# EasyEDA Pro project ProProject_阵列式磁场检测仪_2024-06-02.epro, schematic Schematic3
Create Date: 2024-05-17; Page Name: P1; Project Name: 阵列式磁场检测仪; Schematic Name: Schematic3; Update Date: 2024-05-17; Company: 嘉立创EDA; Page Size: A4; Version: V1.0
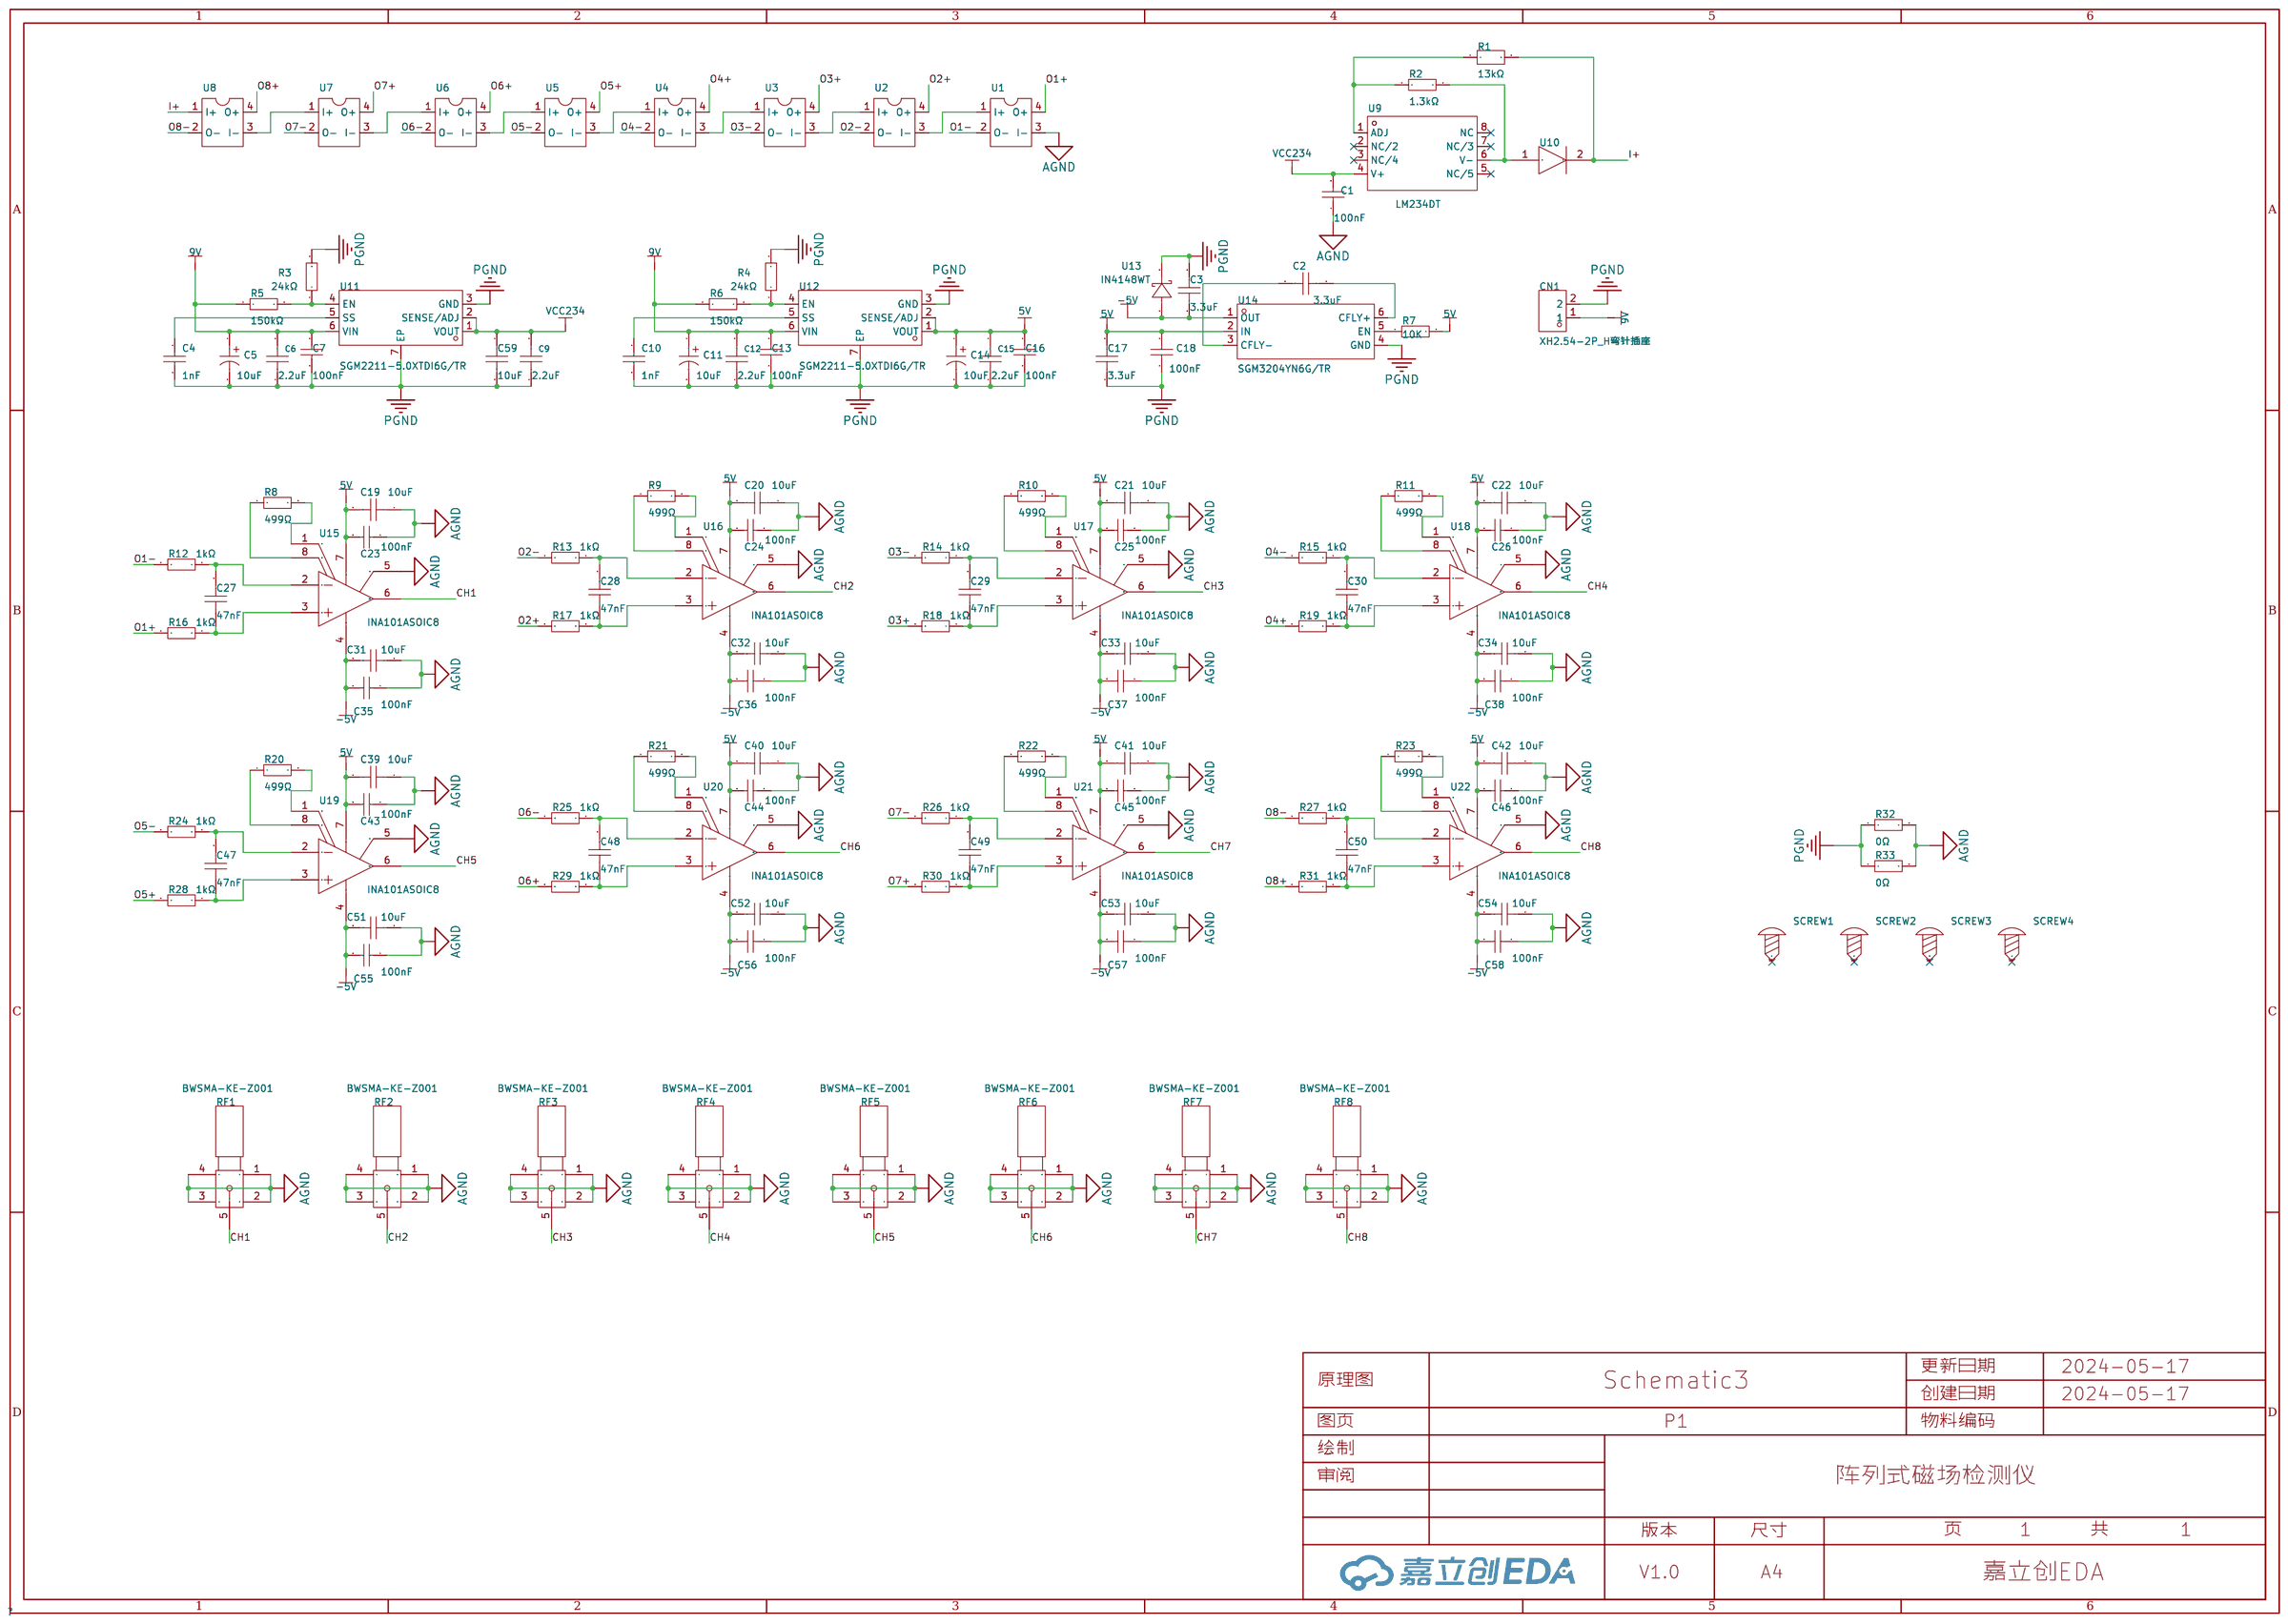
[diagram p3: schematic sheet]

## Parts
C1  100nF  [C0603]
C2  3.3uF  [C0603]
C3  3.3uF  [C0603]
C4  1nF  [C0603]
C5  10uF  [CAP-SMD_BD5.0-L5.3-W5.3-FD]
C6  2.2uF  [C0603]
C7  100nF  [C0603]
C9  2.2uF  [C0603]
C10  1nF  [C0603]
C11  10uF  [CAP-SMD_BD5.0-L5.3-W5.3-FD]
C12  2.2uF  [C0603]
C13  100nF  [C0603]
C14  10uF  [CAP-SMD_BD5.0-L5.3-W5.3-FD]
C15  2.2uF  [C0603]
C16  100nF  [C0603]
C17  3.3uF  [C0603]
C18  100nF  [C0603]
C19  10uF  [C0805]
C20  10uF  [C0805]
C21  10uF  [C0805]
C22  10uF  [C0805]
C23  100nF  [C0603]
C24  100nF  [C0603]
C25  100nF  [C0603]
C26  100nF  [C0603]
C27  47nF  [C0603]
C28  47nF  [C0603]
C29  47nF  [C0603]
C30  47nF  [C0603]
C31  10uF  [C0805]
C32  10uF  [C0805]
C33  10uF  [C0805]
C34  10uF  [C0805]
C35  100nF  [C0603]
C36  100nF  [C0603]
C37  100nF  [C0603]
C38  100nF  [C0603]
C39  10uF  [C0805]
C40  10uF  [C0805]
C41  10uF  [C0805]
C42  10uF  [C0805]
C43  100nF  [C0603]
C44  100nF  [C0603]
C45  100nF  [C0603]
C46  100nF  [C0603]
C47  47nF  [C0603]
C48  47nF  [C0603]
C49  47nF  [C0603]
C50  47nF  [C0603]
C51  10uF  [C0805]
C52  10uF  [C0805]
C53  10uF  [C0805]
C54  10uF  [C0805]
C55  100nF  [C0603]
C56  100nF  [C0603]
C57  100nF  [C0603]
C58  100nF  [C0603]
C59  10uF  [C0805]
CN1  XH2.54-2P_H弯针插座  [CONN-TH_2P-P2.5_XH2.54-2P_H]
R1  13kΩ  [R0603]
R2  1.3kΩ  [R0603]
R3  24kΩ  [R0603]
R4  24kΩ  [R0603]
R5  150kΩ  [R0603]
R6  150kΩ  [R0603]
R7  10K  [R0603]
R8  499Ω  [R0603]
R9  499Ω  [R0603]
R10  499Ω  [R0603]
R11  499Ω  [R0603]
R12  1kΩ  [R0603]
R13  1kΩ  [R0603]
R14  1kΩ  [R0603]
R15  1kΩ  [R0603]
R16  1kΩ  [R0603]
R17  1kΩ  [R0603]
R18  1kΩ  [R0603]
R19  1kΩ  [R0603]
R20  499Ω  [R0603]
R21  499Ω  [R0603]
R22  499Ω  [R0603]
R23  499Ω  [R0603]
R24  1kΩ  [R0603]
R25  1kΩ  [R0603]
R26  1kΩ  [R0603]
R27  1kΩ  [R0603]
R28  1kΩ  [R0603]
R29  1kΩ  [R0603]
R30  1kΩ  [R0603]
R31  1kΩ  [R0603]
R32  0Ω  [R1206]
R33  0Ω  [R1206]
RF1  BWSMA-KE-Z001  [SMA-TH_BWSMA-KE-Z001]
RF2  BWSMA-KE-Z001  [SMA-TH_BWSMA-KE-Z001]
RF3  BWSMA-KE-Z001  [SMA-TH_BWSMA-KE-Z001]
RF4  BWSMA-KE-Z001  [SMA-TH_BWSMA-KE-Z001]
RF5  BWSMA-KE-Z001  [SMA-TH_BWSMA-KE-Z001]
RF6  BWSMA-KE-Z001  [SMA-TH_BWSMA-KE-Z001]
RF7  BWSMA-KE-Z001  [SMA-TH_BWSMA-KE-Z001]
RF8  BWSMA-KE-Z001  [SMA-TH_BWSMA-KE-Z001]
SCREW1  -  [M3螺丝]
SCREW2  -  [M3螺丝]
SCREW3  -  [M3螺丝]
SCREW4  -  [M3螺丝]
U1  -  [HALL]
U2  -  [HALL]
U3  -  [HALL]
U4  -  [HALL]
U5  -  [HALL]
U6  -  [HALL]
U7  -  [HALL]
U8  -  [HALL]
U9  LM234DT  [SOIC-8_L4.9-W3.9-P1.27-LS6.0-BL]
U10  -  [IN457]
U11  SGM2211-5.0XTDI6G/TR  [TDFN-6_L2.0-W2.0-P0.65-BL-EP]
U12  SGM2211-5.0XTDI6G/TR  [TDFN-6_L2.0-W2.0-P0.65-BL-EP]
U13  IN4148WT  [SOD-523_L1.2-W0.8-LS1.6-FD]
U14  SGM3204YN6G/TR  [SOT-23-6_L2.9-W1.6-P0.95-LS2.8-BR]
U15  INA101ASOIC8  [SOIC-8_L4.9-W3.9-P1.27-LS6.0-BL]
U16  INA101ASOIC8  [SOIC-8_L4.9-W3.9-P1.27-LS6.0-BL]
U17  INA101ASOIC8  [SOIC-8_L4.9-W3.9-P1.27-LS6.0-BL]
U18  INA101ASOIC8  [SOIC-8_L4.9-W3.9-P1.27-LS6.0-BL]
U19  INA101ASOIC8  [SOIC-8_L4.9-W3.9-P1.27-LS6.0-BL]
U20  INA101ASOIC8  [SOIC-8_L4.9-W3.9-P1.27-LS6.0-BL]
U21  INA101ASOIC8  [SOIC-8_L4.9-W3.9-P1.27-LS6.0-BL]
U22  INA101ASOIC8  [SOIC-8_L4.9-W3.9-P1.27-LS6.0-BL]

## Library data of the parts
C1 C7 C13 C16 C18 C23-C26 C35-C38 C43-C46 C55-C58 = 0603B104K500NT: 容值:100nF;精度:±10%;额定电压:50V;材质(温度系数):X7R;; LCSC Part Name: 100nF ±10% 50V; Supplier Part: C30926; Manufacturer: FH(风华); Supplier Footprint: 0603; Datasheet: https://atta.szlcsc.com/upload/public/pdf/source/20200305/C486355_26A10D38EF8C2A5C37091D0039909270.pdf; Supplier: LCSC; Tolerance: ±10%; Voltage Rated: 50V; Temperature Coefficient: X7R
C2 C3 C17 = C1608X5R1E335KT000E: 容值:3.3uF;精度:±10%;额定电压:25V;材质(温度系数):X5R;; LCSC Part Name: 3.3uF ±10% 25V; Supplier Part: C342962; Manufacturer: TDK; Supplier Footprint: 0603; Datasheet: https://atta.szlcsc.com/upload/public/pdf/source/20190612/C361180_85CC9FB0751BEA97238DE56AB4AF0B1F.pdf; Supplier: LCSC; Tolerance: ±10%; Voltage Rated: 25V; Temperature Coefficient: X5R
C4 C10 = CC0603KRX7R9BB102: 容值:1nF;精度:±10%;额定电压:50V;材质(温度系数):X7R;; LCSC Part Name: 1nF ±10% 50V; Supplier Part: C100040; Manufacturer: YAGEO(国巨); Supplier Footprint: 0603; Datasheet: https://atta.szlcsc.com/upload/public/pdf/source/20180910/C282072_33301C7F631E79921B82A8DAC6BCC5B3.pdf; Supplier: LCSC; Tolerance: ±10%; Voltage Rated: 50V; Temperature Coefficient: X7R
C5 C11 C14 = RST10UF50V016: 容值:10uF;精度:±20%;额定电压:50V;纹波电流:24mA@120Hz;等效串联电阻:-;; LCSC Part Name: 10uF ±20% 50V; Supplier Part: C4747971; Manufacturer: KNSCHA(科尼盛); Supplier Footprint: SMD,D5xL5.4mm; Datasheet: https://atta.szlcsc.com/upload/public/pdf/source/20220722/47144637C831FC4476CE4962252D8002.pdf; Supplier: LCSC; Tolerance: ±20%; Rated Voltage: 50V; Ripple Current: 24mA@120Hz; φD: 5mm; L: 5.4mm; Lifetime @ Temp: 2000hrs@105℃; Operating Temperature: -40℃~+105℃
C6 C9 C12 C15 = CL10A225KB8NNNC: 容值:2.2uF;精度:±10%;额定电压:50V;材质(温度系数):X5R;; LCSC Part Name: 2.2uF ±10% 50V; Supplier Part: C913904; Manufacturer: SAMSUNG(三星); Supplier Footprint: 0603; Datasheet: https://atta.szlcsc.com/upload/public/pdf/source/20160218/1457707763339.pdf; Supplier: LCSC; Tolerance: ±10%; Voltage Rated: 50V; Temperature Coefficient: X5R
C19-C22 C31-C34 C39-C42 C51-C54 C59 = CL21A106KAYNNNE_C15850: 容值:10uF;精度:±10%;额定电压:25V;材质(温度系数):X5R;; LCSC Part Name: 10uF ±10% 25V; Supplier Part: C15850; Manufacturer: SAMSUNG(三星); Manufacturer Part: CL21A106KAYNNNE; Supplier Footprint: 0805; Datasheet: https://atta.szlcsc.com/upload/public/pdf/source/20160218/1457707763339.pdf; Supplier: LCSC; Tolerance: ±10%; Voltage Rated: 25V; Temperature Coefficient: X5R
C27-C30 C47-C50 = 0603B473K500NT: 容值:47nF;精度:±10%;额定电压:50V;材质(温度系数):X7R;; LCSC Part Name: 47nF ±10% 50V; Supplier Part: C285123; Manufacturer: FH(风华); Supplier Footprint: 0603; JLCPCB Part Class: 扩展库; Datasheet: https://atta.szlcsc.com/upload/public/pdf/source/20200305/C486355_26A10D38EF8C2A5C37091D0039909270.pdf; Supplier: LCSC; Tolerance: ±10%; Voltage Rated: 50V; Temperature Coefficient: X7R
CN1 = XH2.54-2P_H弯针插座: Supplier Part: C2915111; Supplier Footprint: TH-2P; JLCPCB Part Class: 扩展库; Supplier: LCSC
R1 = MR06X1302FTL: 阻值:13kΩ;精度:±1%;功率:125mW;最大工作电压:75V;温度系数:±100ppm/℃;; LCSC Part Name: 13kΩ ±1% 125mW; Supplier Part: C431728; Manufacturer: Walsin(华新科); Supplier Footprint: 0603; JLCPCB Part Class: 扩展库; Datasheet: https://atta.szlcsc.com/upload/public/pdf/source/20190927/C431928_EFD0274D1DCD4BC1E8C9515D468AAF68.pdf; Supplier: LCSC; Tolerance: ±1%; Power(Watts): 125mW; Overload Voltage (Max): 75V; Temperature Coefficient: ±100ppm/℃; Operating Temperature Range: -55℃~+155℃
R2 = PTFR0603B1K30P9: 电阻类型:薄膜电阻;阻值:1.3kΩ;精度:±0.1%;功率:100mW;最大工作电压:100V;温度系数:±25ppm/℃;; LCSC Part Name: 薄膜电阻 1.3kΩ ±0.1% 100mW; Supplier Part: C351672; Manufacturer: RESI(开步睿思）; Supplier Footprint: 0603; JLCPCB Part Class: 扩展库; Datasheet: https://atta.szlcsc.com/upload/public/pdf/source/20231020/37F75D505DFC5CA75CC16B0F0ECD8764.pdf; Supplier: LCSC; Type: 薄膜电阻; Tolerance: ±0.1%; Power(Watts): 100mW; Overload Voltage (Max): 100V; Temperature Coefficient: ±25ppm/℃; Operating Temperature Range: -55℃~+125℃
R3 R4 = 0603WAF2402T5E: 电阻类型:厚膜电阻;阻值:24kΩ;精度:±1%;功率:100mW;最大工作电压:75V;温度系数:±100ppm/℃;; LCSC Part Name: 24kΩ ±1% 100mW 厚膜电阻; Supplier Part: C23352; Manufacturer: UNI-ROYAL(厚声); Supplier Footprint: 0603; JLCPCB Part Class: 基础库; Datasheet: https://atta.szlcsc.com/upload/public/pdf/source/20200306/C422600_1E6D84923E4A46A82E41ADD87F860B5C.pdf; Supplier: LCSC; Type: 厚膜电阻; Tolerance: ±1%; Power(Watts): 100mW; Overload Voltage (Max): 75V; Temperature Coefficient: ±100ppm/℃; Operating Temperature Range: -55℃~+155℃
R5 R6 = 0603WAF1503T5E: 电阻类型:厚膜电阻;阻值:150kΩ;精度:±1%;功率:100mW;最大工作电压:75V;温度系数:±100ppm/℃;; LCSC Part Name: 150kΩ ±1% 100mW 厚膜电阻; Supplier Part: C22807; Manufacturer: UNI-ROYAL(厚声); Supplier Footprint: 0603; JLCPCB Part Class: 基础库; Datasheet: https://atta.szlcsc.com/upload/public/pdf/source/20200306/C422600_1E6D84923E4A46A82E41ADD87F860B5C.pdf; Supplier: LCSC; Type: 厚膜电阻; Tolerance: ±1%; Power(Watts): 100mW; Overload Voltage (Max): 75V; Temperature Coefficient: ±100ppm/℃; Operating Temperature Range: -55℃~+155℃
R7 = Res_0603: Supplier Footprint: 0603
R8-R11 R20-R23 = 0603WAF4990T5E: 电阻类型:厚膜电阻;阻值:499Ω;精度:±1%;功率:100mW;最大工作电压:75V;温度系数:±100ppm/℃;; LCSC Part Name: 499Ω ±1% 100mW 厚膜电阻; Supplier Part: C23065; Manufacturer: UNI-ROYAL(厚声); Supplier Footprint: 0603; Datasheet: https://atta.szlcsc.com/upload/public/pdf/source/20200306/C422600_1E6D84923E4A46A82E41ADD87F860B5C.pdf; Supplier: LCSC; Type: 厚膜电阻; Tolerance: ±1%; Power(Watts): 100mW; Overload Voltage (Max): 75V; Temperature Coefficient: ±100ppm/℃; Operating Temperature Range: -55℃~+155℃
R12-R19 R24-R31 = 0603WAF1001T5E: 电阻类型:厚膜电阻;阻值:1kΩ;精度:±1%;功率:100mW;最大工作电压:75V;温度系数:±100ppm/℃;; LCSC Part Name: 1kΩ ±1% 100mW 厚膜电阻; Supplier Part: C21190; Manufacturer: UNI-ROYAL(厚声); Supplier Footprint: 0603; Datasheet: https://atta.szlcsc.com/upload/public/pdf/source/20200306/C422600_1E6D84923E4A46A82E41ADD87F860B5C.pdf; Supplier: LCSC; Type: 厚膜电阻; Tolerance: ±1%; Power(Watts): 100mW; Overload Voltage (Max): 75V; Temperature Coefficient: ±100ppm/℃; Operating Temperature Range: -55℃~+155℃
R32 R33 = 1206W4F0000T5E: 电阻类型:厚膜电阻;阻值:0Ω;精度:±1%;功率:250mW;最大工作电压:200V;温度系数:±800ppm/℃;; LCSC Part Name: 0Ω ±1% 250mW 厚膜电阻; Supplier Part: C17888; Manufacturer: UNI-ROYAL(厚声); Supplier Footprint: 1206; JLCPCB Part Class: 基础库; Datasheet: https://atta.szlcsc.com/upload/public/pdf/source/20200306/C422600_1E6D84923E4A46A82E41ADD87F860B5C.pdf; Supplier: LCSC; Type: 厚膜电阻; Tolerance: ±1%; Power(Watts): 250mW; Overload Voltage (Max): 200V; Temperature Coefficient: ±800ppm/℃; Operating Temperature Range: -55℃~+155℃
RF1-RF8 = BWSMA-KE-Z001_C496549: 连接器类型:板端;接口类型:内孔;端口数量:1;接口直径:-;接口长度/高度:-;频率-最大值:-;射频系列:SMA;阻抗:50Ω;样式:正脚;触头材质:-;触头镀层:-;工作温度范围:-65℃~+165℃;焊接温度(最大值):-;; LCSC Part Name: 内孔 SMA 正脚; Supplier Part: C496549; Manufacturer: BAT WIRELESS(蝙蝠无线); Supplier Footprint: 插件; JLCPCB Part Class: 扩展库; Datasheet: https://atta.szlcsc.com/upload/public/pdf/source/20221228/40BF41E56A06003A0210E1785CA66EA6.pdf; Supplier: LCSC; Connector Type: 板端; Interface Type: 内孔; Number of Ports: 1; RF Series: SMA; Impedance: 50Ω; Style: 正脚; Operating Temperature Range: -65℃~+165℃
SCREW1-SCREW4 = M3螺丝: Supplier Footprint: 插件
U1-U8 = HALL
U9 = LM234DT: 工作电压:1V~40V;输出电流:10mA;精度:±3%;; LCSC Part Name: 10mA 电流源 40V; Supplier Part: C157402; Manufacturer: ST(意法半导体); Supplier Footprint: SOIC-8; Datasheet: https://atta.szlcsc.com/upload/public/pdf/source/20180125/C157402_15168648817961302756.pdf; Supplier: LCSC; Type: 电流源; Supply Voltage: 1V~40V; Output Current: 10mA; Tolerance: ±3%; Operating Temperature: -25℃~+100℃
U10 = IN457
U11 U12 = SGM2211-1.8XTDI6G/TR: Supplier Part: C5152834; Manufacturer: SGMICRO(圣邦微); Supplier Footprint: TDFN-6AL(2x2); JLCPCB Part Class: 扩展库; Datasheet: https://atta.szlcsc.com/upload/public/pdf/source/20220928/26A0674FCF0885761ED3B533E1830369.pdf; Supplier: LCSC
U13 = IN4148WT: Supplier Part: C9900015724; Supplier Footprint: DIODEGENPURP100V150MASOD-523; JLCPCB Part Class: 扩展库; Supplier: LCSC
U14 = SGM3204YN6G/TR: 功能类型:-;输入电压:1.4V~5.5V;输出电压:-5.5V~-1.4V;输出电流(最大值):200mA;; Supplier Part: C194031; Manufacturer: SGMICRO(圣邦微); Supplier Footprint: SOT-23-6; Datasheet: https://atta.szlcsc.com/upload/public/pdf/source/20180627/C194031_755051E53122D645C36CF727711B963E.pdf; Supplier: LCSC; Input Voltage: 1.4V~5.5V; Output Voltage: -5.5V~-1.4V; Output Current (Max): 200mA; Switching Frequency: 950kHz; Number of Outputs: 1; Switch tube (built-in/external): 内置
U15-U22 = INA101ASOIC8: 放大器数:-;共模抑制比(CMRR):104dB;输入偏置电流(Ib):1nA;输入失调电压(Vos):2.5uV;增益带宽积(GBP):-;压摆率(SR):-;带宽(-3db):1.3MHz;轨到轨:-;; LCSC Part Name: 线性产品; Supplier Part: C5359442; Manufacturer: analogysemi(类比半导体); Supplier Footprint: SOIC-8; JLCPCB Part Class: 扩展库; Datasheet: https://atta.szlcsc.com/upload/public/pdf/source/20230221/88ECF15C5A4D3235CE0DAFCB201D4D48.pdf; Supplier: LCSC; Common Mode Rejection Ratio (CMRR): 104dB; Current - Input Bias(Ib): 1nA; Voltage - Input Offset(Vos): 2.5uV; Supply Voltage: 4V~38V; -3db Bandwidth: 1.3MHz; Supply Current: 1.56mA; Input Offset Voltage Drift (Vos TC): 0.02uV/°C; Operating Temperature: -55℃~+125℃

## Nets
5V: C14.1 C15.2 C16.2 C17.2 C18.2 C19.2 C20.2 C21.2 C22.2 C23.2 C24.2 C25.2 C26.2 C39.2 C40.2 C41.2 C42.2 C43.2 C44.2 C45.2 C46.2 R7.2 U12.1(VOUT) U12.2(SENSE/ADJ) U14.2(IN) U15.7(+VS) U16.7(+VS) U17.7(+VS) U18.7(+VS) U19.7(+VS) U20.7(+VS) U21.7(+VS) U22.7(+VS)
9V: C5.1 C6.2 C7.2 C11.1 C12.2 C13.2 CN1.1 R5.1 R6.1 U11.6(VIN) U12.6(VIN)
-5V: C3.2 C31.2 C32.2 C33.2 C34.2 C35.2 C36.2 C37.2 C38.2 C51.2 C52.2 C53.2 C54.2 C55.2 C56.2 C57.2 C58.2 U13.1(A) U14.1(OUT) U15.4(–VS) U16.4(–VS) U17.4(–VS) U18.4(–VS) U19.4(–VS) U20.4(–VS) U21.4(–VS) U22.4(–VS)
AGND: C1.1 C19.1 C20.1 C21.1 C22.1 C23.1 C24.1 C25.1 C26.1 C31.1 C32.1 C33.1 C34.1 C35.1 C36.1 C37.1 C38.1 C39.1 C40.1 C41.1 C42.1 C43.1 C44.1 C45.1 C46.1 C51.1 C52.1 C53.1 C54.1 C55.1 C56.1 C57.1 C58.1 R32.2 R33.2 RF1.1 RF1.2 RF1.3 RF1.4 RF2.1 RF2.2 RF2.3 RF2.4 RF3.1 RF3.2 RF3.3 RF3.4 RF4.1 RF4.2 RF4.3 RF4.4 RF5.1 RF5.2 RF5.3 RF5.4 RF6.1 RF6.2 RF6.3 RF6.4 RF7.1 RF7.2 RF7.3 RF7.4 RF8.1 RF8.2 RF8.3 RF8.4 U1.3(I-) U15.5(REF) U16.5(REF) U17.5(REF) U18.5(REF) U19.5(REF) U20.5(REF) U21.5(REF) U22.5(REF)
PGND: C3.1 C4.2 C5.2 C6.1 C7.1 C9.1 C10.2 C11.2 C12.1 C13.1 C14.2 C15.1 C16.1 C17.1 C18.1 C59.2 CN1.2 R3.2 R4.2 R32.1 R33.1 U11.3(GND) U11.7(EP) U12.3(GND) U12.7(EP) U13.2(K) U14.4(GND)
VCC234: C1.2 C9.2 C59.1 U9.4(V+) U11.1(VOUT) U11.2(SENSE/ADJ)
CH1: RF1.5 U15.6(OUTPUT)
CH2: RF2.5 U16.6(OUTPUT)
CH3: RF3.5 U17.6(OUTPUT)
CH4: RF4.5 U18.6(OUTPUT)
CH5: RF5.5 U19.6(OUTPUT)
CH6: RF6.5 U20.6(OUTPUT)
CH7: RF7.5 U21.6(OUTPUT)
CH8: RF8.5 U22.6(OUTPUT)
I+: R1.2 U8.1(I+) U10.2
O1+: R16.2 U1.4(O+)
O1-: R12.2 U1.2(O-)
O2+: R17.2 U2.4(O+)
O2-: R13.2 U2.2(O-)
O3+: R18.2 U3.4(O+)
O3-: R14.2 U3.2(O-)
O4+: R19.2 U4.4(O+)
O4-: R15.2 U4.2(O-)
O5+: R28.2 U5.4(O+)
O5-: R24.2 U5.2(O-)
O6+: R29.2 U6.4(O+)
O6-: R25.2 U6.2(O-)
O7+: R30.2 U7.4(O+)
O7-: R26.2 U7.2(O-)
O8+: R31.2 U8.4(O+)
O8-: R27.2 U8.2(O-)
$1N695: R2.2 U9.6(V-) U10.1
$1N696: R1.1 R2.1 U9.1(ADJ)
$1N1719: C4.1 U11.5(SS)
$1N1720: R3.1 R5.2 U11.4(EN)
$1N2456: C10.1 U12.5(SS)
$1N2457: R4.1 R6.2 U12.4(EN)
$1N2463: C2.2 U14.3(CFLY-)
$1N2464: C2.1 U14.6(CFLY+)
$1N2468: R7.1 U14.5(EN)
$1N5661: R8.1 U15.8(RG)
$1N5662: R8.2 U15.1(RG)
$1N5664: C27.1 R16.1 U15.3(+IN)
$1N5665: C27.2 R12.1 U15.2(–IN)
$1N5674: R9.1 U16.8(RG)
$1N5675: R9.2 U16.1(RG)
$1N5677: C28.1 R17.1 U16.3(+IN)
$1N5678: C28.2 R13.1 U16.2(–IN)
$1N5687: R10.1 U17.8(RG)
$1N5688: R10.2 U17.1(RG)
$1N5690: C29.1 R18.1 U17.3(+IN)
$1N5691: C29.2 R14.1 U17.2(–IN)
$1N5700: R11.1 U18.8(RG)
$1N5701: R11.2 U18.1(RG)
$1N5703: C30.1 R19.1 U18.3(+IN)
$1N5704: C30.2 R15.1 U18.2(–IN)
$1N5713: R20.1 U19.8(RG)
$1N5714: R20.2 U19.1(RG)
$1N5716: C47.1 R28.1 U19.3(+IN)
$1N5717: C47.2 R24.1 U19.2(–IN)
$1N5726: R21.1 U20.8(RG)
$1N5727: R21.2 U20.1(RG)
$1N5729: C48.1 R29.1 U20.3(+IN)
$1N5730: C48.2 R25.1 U20.2(–IN)
$1N5739: R22.1 U21.8(RG)
$1N5740: R22.2 U21.1(RG)
$1N5742: C49.1 R30.1 U21.3(+IN)
$1N5743: C49.2 R26.1 U21.2(–IN)
$1N5752: R23.1 U22.8(RG)
$1N5753: R23.2 U22.1(RG)
$1N5755: C50.1 R31.1 U22.3(+IN)
$1N5756: C50.2 R27.1 U22.2(–IN)
$1N13134: U7.1(I+) U8.3(I-)
$1N13139: U6.1(I+) U7.3(I-)
$1N13144: U5.1(I+) U6.3(I-)
$1N13149: U4.1(I+) U5.3(I-)
$1N13154: U3.1(I+) U4.3(I-)
$1N13159: U2.1(I+) U3.3(I-)
$1N13164: U1.1(I+) U2.3(I-)

Not connected (* = marked no-connect by the designer): SCREW1 1*; SCREW2 1*; SCREW3 1*; SCREW4 1*; U9 2(NC/2)* 3(NC/4)* 5(NC/5)* 7(NC/3)* 8(NC)*
